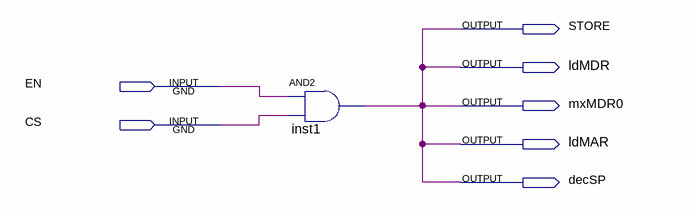
[diagram p0: schematic sheet]
// Quartus schematic PHP.bdf as structural Verilog: 1 symbols, 7 pins
module PHP (
  input  EN,
  input  CS,
  output STORE,
  output ldMDR,
  output mxMDR0,
  output ldMAR,
  output decSP
);

  and inst1 (decSP, EN, CS);

  assign ldMAR = decSP;
  assign ldMDR = decSP;
  assign mxMDR0 = decSP;
  assign STORE = decSP;
endmodule
